# EAGLE design Simonette_PTH (EAGLE 5.11)
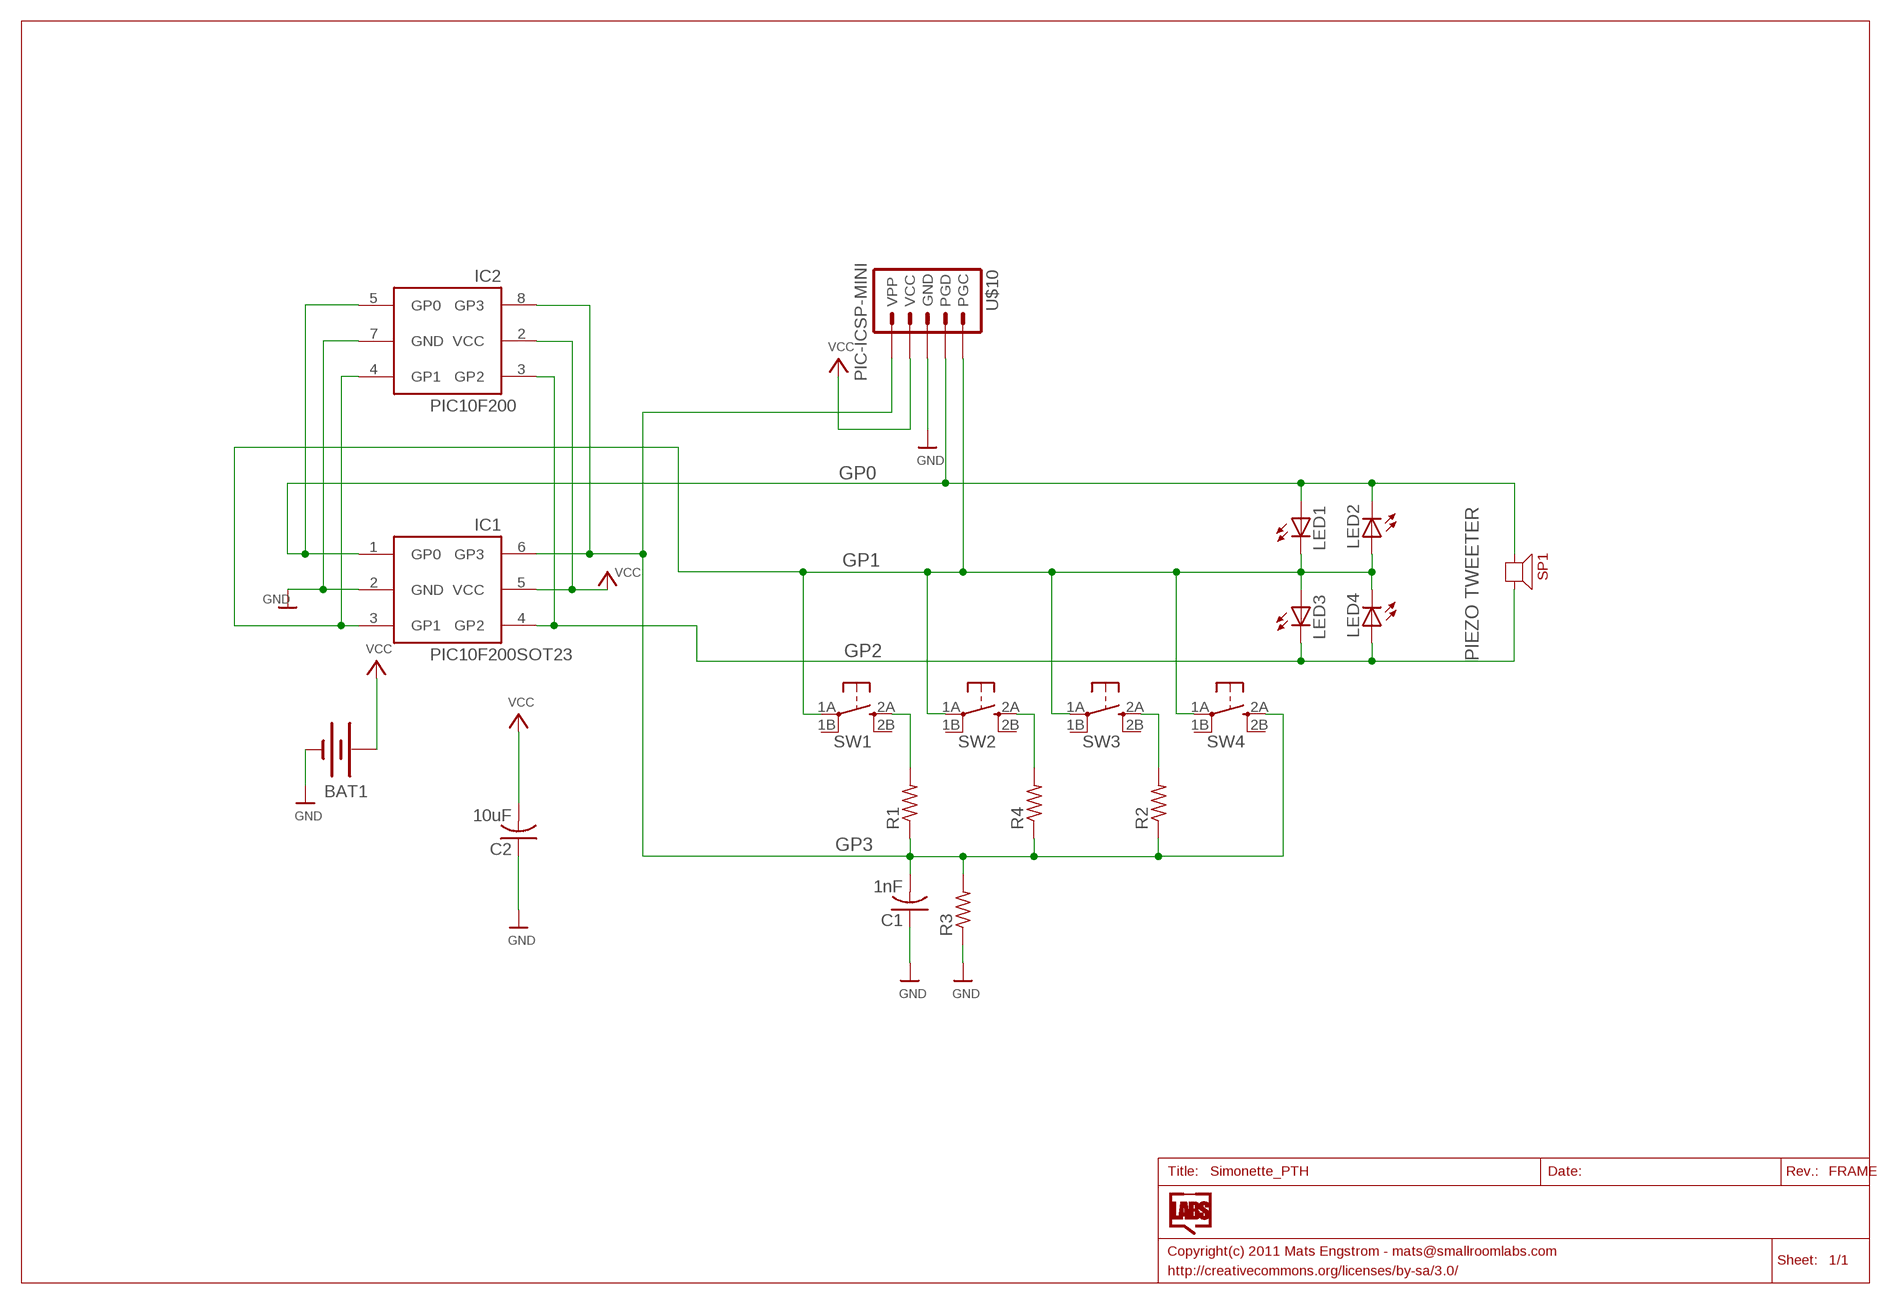
[diagram p0: schematic, sheet 1]

## Parts
BAT1  BATTERYFOB  [BATTERY_20MM_PTH_COMPACT]
C1  1nF  C-US025-025X050  [C025-025X050]
C2  10uF  C-US025-025X050  [C025-025X050]
IC1  PIC10F200SOT23  PIC10F200-SOT23  [SOT23-6]
IC2  PIC10F200  PIC10F200-DIPO  [DIL08-OFFSET]
LED1  LED5MM  [LED5MM]
LED2  LED5MM  [LED5MM]
LED3  LED5MM  [LED5MM]
LED4  LED5MM  [LED5MM]
R1  R-US_0204/7  [0204/7]
R2  R-US_0204/7  [0204/7]
R3  R-US_0204/7  [0204/7]
R4  R-US_0204/7  [0204/7]
SP1  SPEAKER2&3  [PIEZO12MM-2&3]
SW1  TACTILETACT-6X6-PTH  [TACTILE-PTH]
SW2  TACTILETACT-6X6-PTH  [TACTILE-PTH]
SW3  TACTILETACT-6X6-PTH  [TACTILE-PTH]
SW4  TACTILETACT-6X6-PTH  [TACTILE-PTH]
U$10  PIC-ICSP-MINI  [PIC-ICSP-MINI]

## Nets
GND: BAT1.2(-) C1.1 C2.1 IC1.2(GND) IC2.7(GND) R3.1 U$10.3(GND)
GP0: IC1.1(GP0) IC2.5(GP0) LED1.A LED2.K(C) SP1.P$1 U$10.4(PGD)
GP1: IC1.3(GP1) IC2.4(GP1) LED1.K(C) LED2.A LED3.A LED4.K(C) SW1.1A SW2.1A SW3.1A SW4.1A U$10.5(PGC)
GP2: IC1.4(GP2) IC2.3(GP2) LED3.K(C) LED4.A SP1.P$2
GP3: C1.2 IC1.6(GP3) IC2.8(GP3) R1.1 R2.1 R3.2 R4.1 SW4.2A U$10.1(VPP)
N$1: R1.2 SW1.2A
N$3: R4.2 SW2.2A
N$4: R2.2 SW3.2A
VCC: BAT1.1(+) C2.2 IC1.5(VCC) IC2.2(VCC) U$10.2(VCC)
Unconnected: SW1.1B SW1.2B SW2.1B SW2.2B SW3.1B SW3.2B SW4.1B SW4.2B

## Notes on the sheet
- PIEZO TWEETER

## Library data of the parts
BAT1 = SparkFun:BATTERY: Battery Holders Various common sizes : AA, AAA, 20mm coin cell and 12mm coin cell.
C1 C2 = adafruit:C-US: CAPACITOR, American symbol
IC1 IC2 = SmallRoomLabs:PIC10F200
LED1-LED4 = adafruit:LED: LED OSRAM: - CHIPLED LG R971, LG N971, LY N971, LG Q971, LY Q971, LO R971, LY R971 LH N974, LH R974 LS Q976, LO Q976, LY Q976 LO Q996 - Hyper CHIPLED LW Q18S LB Q993, LB Q99A, LB R99A - SideLED LS A670, LO A670, LY A670, LG A670, LP A670 LB A673, LV A673, LT A673, LW A673 LH A674 LY A675 LS A676, LA A676, LO A676, LY A676, LW A676 LS A679, LY A679, LG A679 - Hyper Micro SIDELED® LS Y876, LA Y876, LO Y876, LY Y876 LT Y87S - SmartLED LW L88C, LW L88S LB L89C, LB L89S, LG L890 LS L89K, LO L89K, LY L89K LS L896, LA L896, LO L896, LY L896 - TOPLED LS T670, LO T670, LY T670, LG T670, LP T670 LSG T670, LSP T670, LSY T670, LOP T670, LYG T670 LG T671, LOG T671, LSG T671 LB T673, LV T673, LT T673, LW T673 LH T674 LS T676, LA T676, LO T676, LY T676, LB T676, LH T676, LSB T676, LW T676 LB T67C, LV T67C, LT T67C, LS T67K, LO T67K, LY T67K, LW E67C LS E67B, LA E67B, LO E67B, LY E67B, LB E67C, LV E67C, LT E67C LW T67C LS T679, LY T679, LG T679 LS T770, LO T770, LY T770, LG T770, LP T770 LB T773, LV T773, LT T773, LW T773 LH T774 LS E675, LA E675, LY E675, LS T675 LS T776, LA T776, LO T776, LY T776, LB T776 LHGB T686 LT T68C, LB T68C - Hyper Mini TOPLED® LB M676 - Mini TOPLED Santana® LG M470 LS M47K, LO M47K, LY M47K Source: http://www.osram.convergy.de/
R1-R4 = adafruit:R-US_: RESISTOR, American symbol
SP1 = SmallRoomLabs:SPEAKER
SW1-SW4 = SmallRoomLabs:TACTILE
U$10 = SparkFun:PIC-ICSP-MINI: PIC-ICSP-Mini Miniature 5-pin connection for temporary programming of PICs. Use this device in your design to save space. Program the PIC with this adapter Spark Fun Electronics SKU : BOB-00194

## Net classes
0 default: width 0.305 mm, clearance 0.305 mm

## Board
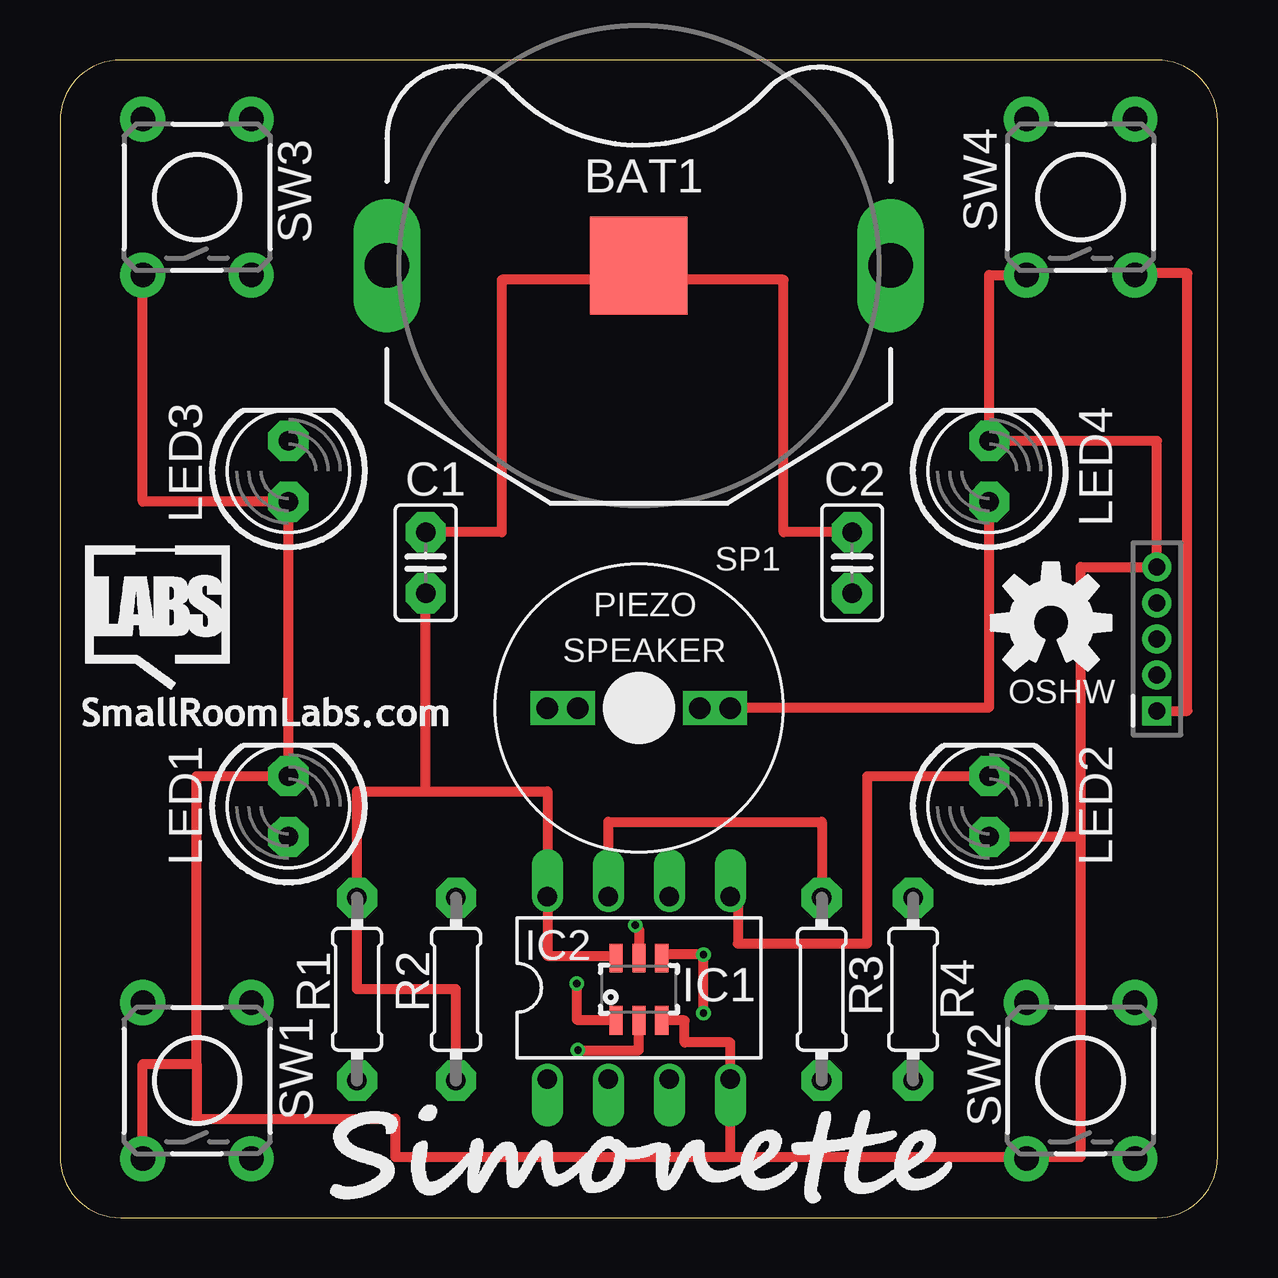
[diagram p1: board, top side]
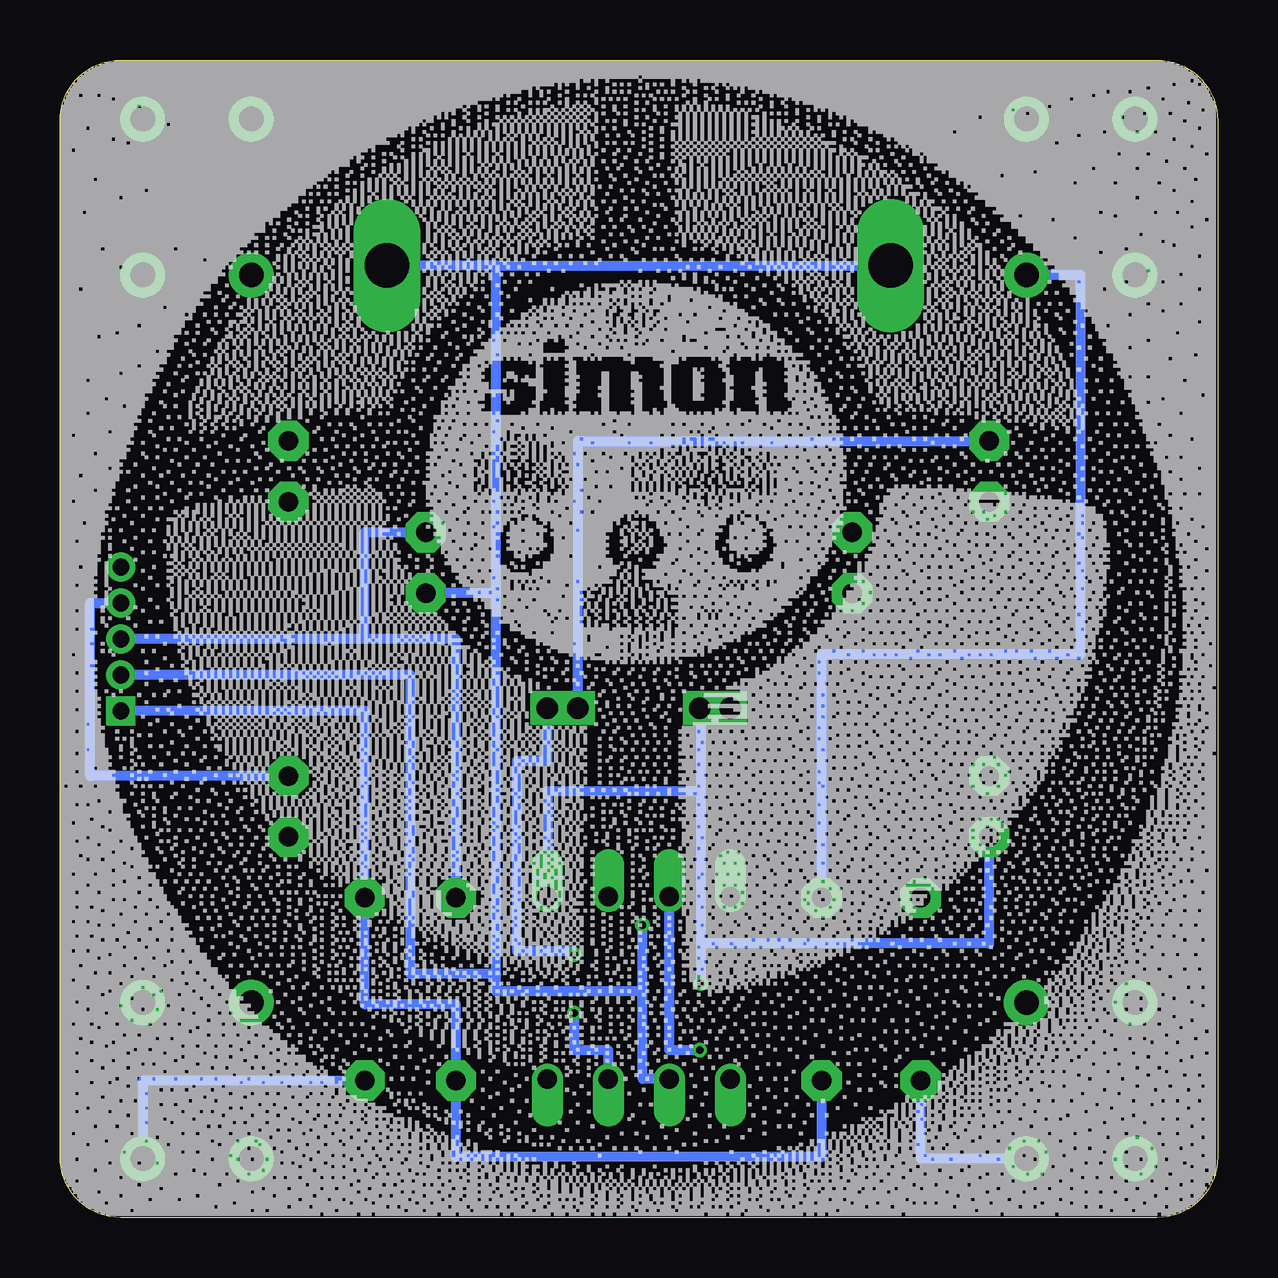
[diagram p2: board, bottom side, seen from below]

Size 48.26 x 48.26 mm. Coordinates in mm from the lower left corner, seen from the top.
Outline: 0,2.54 arc90 2.54,0 45.72,0 arc90 48.26,2.54 48.26,45.72 arc90 45.72,48.26 2.54,48.26 arc90 0,45.72 0,2.54
Copper layers (1*16): Top 0.035mm / dielectric 1.5mm / Bottom 0.035mm
Design rules "Fusion_eagle_rule_v1.1": minimum track width 6mil, minimum drill 12mil, track to track 6mil, track to pad 6mil, pad to pad 6mil, via to via 6mil, smd to smd 0mil, copper to edge 10mil, drill to drill 10mil, minimum pad ring 10mil, minimum via ring 6mil, stop-mask expansion 2mil, vias tented up to drill 100mil, thermal gap 10mil
vRestrict: area 22.5,8.3 to 25.7,10.8

### Footprints (pad centres in the part's own frame; a part is rotated, then mirrored left to right if it is on the bottom)
BATTERY_20MM_PTH_COMPACT = drill 1.854 long: 1 -10.5,0; 3 10.5,0 | smd 4.064 x 4.064: 2 0,0
C025-025X050 = drill 0.813 pad 1.676 octagon: 1 -1.27,0; 2 1.27,0
SOT23-6 = smd 0.55 x 1.2: 1 0.32,-1.3; 2 1.27,-1.3; 3 2.22,-1.3; 4 2.22,1.3; 5 1.27,1.3; 6 0.32,1.3
DIL08-OFFSET = drill 0.813 offset: 1 -3.81,-3.81; 2 -1.27,-3.81; 3 1.27,-3.81; 4 3.81,-3.81; 5 3.81,3.81; 6 1.27,3.81; 7 -1.27,3.81; 8 -3.81,3.81
LED5MM = drill 0.813 pad 1.676 octagon: A -1.27,0; K 1.27,0
0204/7 = drill 0.813 pad 1.676 octagon: 1 -3.81,0; 2 3.81,0
PIEZO12MM-2&3 = drill 0.9 square: P$1 -2.54,0; P$1B -3.81,0; P$2 2.54,0; P$2B 3.81,0
TACTILE-PTH = drill 1.016 pad 1.88 round: 1A -3.251,2.261; 1B 3.251,2.261; 2A -3.251,-2.261; 2B 3.251,-2.261
PIC-ICSP-MINI = drill 0.7 square: 1 -3,0 | drill 0.7 round: 2 -1.5,0; 3 0,0; 4 1.5,0; 5 3,0

### Placement (x,y rotation side)
BAT1  24.13,39.69 0 top
C1  15.24,27.3 270 top
C2  33.02,27.3 270 top
IC1  22.86,9.53 0 top
IC2  24.13,9.59 0 top
LED1  9.53,17.14 90 top
LED2  38.73,17.14 90 top
LED3  9.53,31.11 90 top
LED4  38.73,31.11 90 top
R1  12.38,9.53 270 top
R2  16.51,9.53 90 top
R3  31.75,9.53 270 top
R4  35.56,9.53 270 top
SP1  24.13,21.25 0 top
SW1  5.71,5.71 90 top
SW2  42.55,5.71 90 top
SW3  5.71,42.55 90 top
SW4  42.55,42.55 90 top
U$2  [SRL-LOGO-SILK-5MM]  1.03,23.07 0 top
U$9  [OSHW-LOGO-M]  41.31,24.8 0 top
U$10  45.72,24.13 90 top

### Tracks (layer width: path | path; a pad name or v marks a point on that pad's centre or on a via)
GND  (via drill 0.3)
  Top 0.305: BAT1.2 23.24,38.04
  Top 0.406: C1.1 18.41,28.57 18.41,39.1 24.08,39.1 BAT1.2 24.18,39.1 30.16,39.1 30.16,28.57 C2.1 | IC2.7 22.86,16.51 31.75,16.51 R3.1 | IC1.2 24.13,6.99 v21.59,6.99
  Bottom 0.406: IC2.7 22.86,6.99 v21.59,6.99 | R3.1 31.75,24.13 35.56,24.13 | 35.56,24.13 35.56,28.57 C2.1 | 35.56,24.13 U$10.3
GP0  (via drill 0.3)
  Top 0.305: 23.11,8.26 IC1.1
  Top 0.406: 23.11,8.26 21.54,8.26 v21.54,9.75 | IC2.5 28.26,13.39 28.26,11.43 33.66,11.43 33.66,18.41 LED2.K
  Bottom 0.305: SP1.P$1 21.59,21.21 21.54,21.21
  Bottom 0.406: 21.54,21.25 21.54,21.21 21.54,17.78 | LED1.A 9.53,11.43 21.54,11.43 | 21.54,11.43 v21.54,9.75 | IC2.5 27.94,17.78 21.54,17.78 | 21.54,11.43 21.54,17.78 | U$10.4 46.99,25.63 46.99,18.41 LED2.K
GP1
  Top 0.406: SW4.1A 38.73,39.29 LED4.K 45.72,32.38 U$10.5 42.55,27.13 42.55,15.88 | SW3.1A 3.45,29.84 LED3.A LED1.K 5.69,18.41 5.69,6.41 | 5.69,6.41 3.45,6.41 SW1.1A | 27.94,2.54 IC2.4 27.94,7.3 26.04,7.3 26.04,8.22 IC1.3 | 27.94,2.54 40.28,2.54 | 27.94,2.54 13.97,2.54 13.97,4.13 5.69,4.13 5.69,6.41 | 42.55,15.88 42.55,2.54 40.28,2.54 | 40.28,2.54 SW2.1A | 42.55,15.88 LED2.A
GP2  (via drill 0.3)
  Top 0.305: IC1.4 25.15,10.79
  Top 0.406: IC1.4 25.23,10.97 v26.82,10.97 v26.82,8.53 | SP1.P$2 26.7,21.27 38.73,21.27 LED4.A
  Bottom 0.406: v26.82,10.97 26.82,11.11 29.21,11.11 29.21,19.05 27.94,19.05 27.94,21.27 26.67,21.27 SP1.P$2 26.67,32.38 LED3.K | IC2.3 25.4,6.99 26.82,6.99 v26.82,8.53
GP3
  Top 0.305: 23.11,10.92 IC1.6
  Top 0.406: 15.24,17.78 C1.2 | 15.24,17.78 12.38,17.78 R1.1 12.38,9.53 16.51,9.53 R2.1 | 15.24,17.78 20.32,17.78 IC2.8 20.32,10.92 23.11,10.92 | U$10.1 46.99,21.13 46.99,39.37 44.81,39.37 SW4.2A
  Bottom 0.406: R2.1 16.51,2.54 31.75,2.54 R3.2 31.75,8.89 35.56,8.89 R4.1 35.56,21.13 U$10.1
N$1
  Bottom 0.406: R1.2 12.38,2.46 SW1.2A
N$3
  Bottom 0.406: R4.2 44.81,5.71 SW2.2A
N$4
  Bottom 0.406: R2.2 16.51,23.5 5.71,23.5 5.71,39.29 SW3.2A
VCC  (via drill 0.3)
  Top 0.406: IC1.5 24.13,12.04 v23.98,12.19
  Bottom 0.305: 22.86,5.71 IC2.2 22.86,5.79
  Bottom 0.406: 30.07,39.69 BAT1.1 | 30.07,26.04 30.07,39.69 | 30.07,39.69 34.92,39.69 | 30.07,26.04 C2.2 | U$10.2 33.66,22.63 33.66,10.16 30.07,10.16 | 30.07,10.16 30.07,9.44 23.98,9.44 | 30.07,10.16 30.07,26.04 | 22.86,5.79 23.98,5.79 23.98,9.44 | 23.98,9.44 v23.98,12.19

### Text on the board
tPlace: OSHW